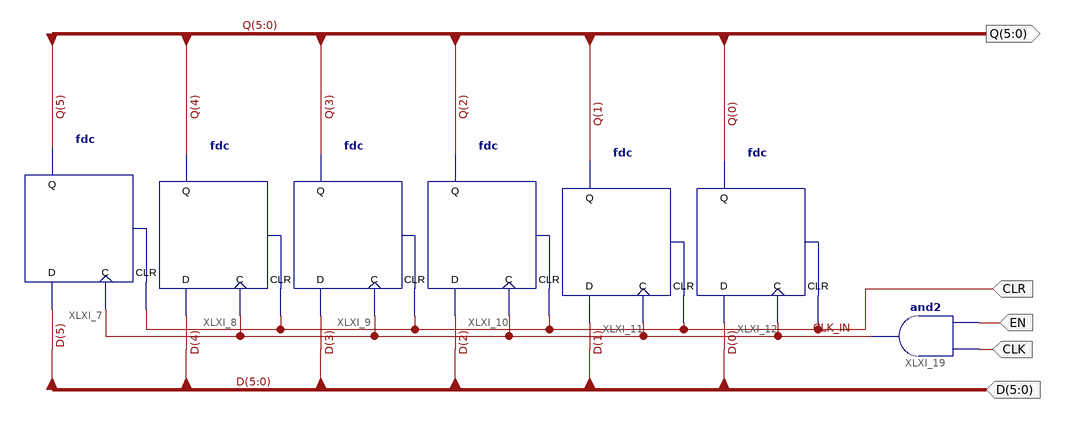
[diagram p0: schematic sheet 1]
// Xilinx ISE schematic REG_6.sch (spartan3e) as structural Verilog: 7 symbols, 5 ports
module REG_6 (
  input  CLR,
  input  [5:0] D,
  input  EN,
  input  CLK,
  output [5:0] Q
);

  wire CLK_IN;

  fdc XLXI_8 (.C(CLK_IN), .CLR(CLR), .D(D[4]), .Q(Q[4]));
  fdc XLXI_9 (.C(CLK_IN), .CLR(CLR), .D(D[3]), .Q(Q[3]));
  fdc XLXI_10 (.C(CLK_IN), .CLR(CLR), .D(D[2]), .Q(Q[2]));
  fdc XLXI_11 (.C(CLK_IN), .CLR(CLR), .D(D[1]), .Q(Q[1]));
  fdc XLXI_12 (.C(CLK_IN), .CLR(CLR), .D(D[0]), .Q(Q[0]));
  fdc XLXI_7 (.C(CLK_IN), .CLR(CLR), .D(D[5]), .Q(Q[5]));
  and XLXI_19 (CLK_IN, EN, CLK);
endmodule
